# EAGLE design sepic (EAGLE 7.2.0)
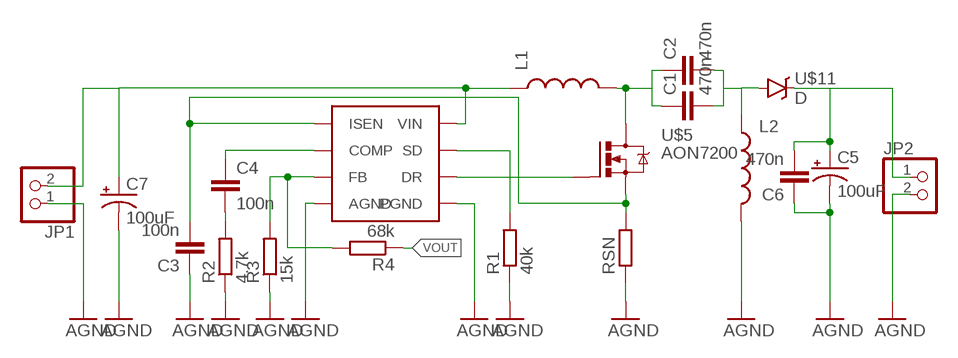
[diagram p0: schematic, sheet 1]

## Parts
C1  470n  CC0805  [C0805]
C2  470n  CC0805  [C0805]
C3  100n  CC0805  [C0805]
C4  100n  CC0805  [C0805]
C5  100uF  100UF-63V-20%(ELECT)  [NIC_10X10.5_CAP]
C6  470n  CC0805  [C0805]
C7  100uF  100UF-63V-20%(ELECT)  [NIC_10X10.5_CAP]
JP1  PINHD-1X02_2.54  [1X02]
JP2  PINHD-1X02_2.54  [1X02]
L1  INDUCTORSRU1038  [SRU1038]
L2  INDUCTORSRU1038  [SRU1038]
R1  40k  R0603  [0603]
R2  4.7k  R0805  [R0805]
R3  15k  R0805  [R0805]
R4  68k  R0805  [R0805]
RSN  R2512  [R2512]
U$1  LM3488  [S-PDSO-G8]
U$5  AON7200  [DFN3X3]
U$11  D  SS14  [SMA-DIODE]

## Nets
AGND: C3.1 C5.- C6.1 C7.- JP1.1 JP2.2 L2.2 R1.1 R2.1 R3.1 RSN.P$1 U$1.4(AGND) U$1.5(PGND)
N$1: C3.2 RSN.P$2 U$1.1(ISEN) U$5.S:1(S) U$5.S:2(S) U$5.S:3(S)
N$2: U$1.6(DR) U$5.G
N$3: R1.2 U$1.7(SD)
N$4: C1.1 C2.1 L1.2 U$5.D U$5.D:1(D) U$5.D:2(D) U$5.D:3(D) U$5.D:4(D) U$5.D:5(D) U$5.D:6(D)
N$5: C1.2 C2.2 L2.1 U$11.A
N$8: C4.1 U$1.2(COMP)
N$9: C4.2 R2.2
N$11: R3.2 R4.2 U$1.3(FB)
VIN: C7.+ JP1.2 L1.1 U$1.8(VIN)
VOUT: C5.+ C6.2 JP2.1 R4.1 U$11.C

## Library data of the parts
C1-C4 C6 = CasaLibrary:C: Capacitor
C5 C7 = SparkFun-Capacitors:100UF-63V-20%(ELECT): CAP-08362 100uF electrolytic SMT 63V 20%; PROD_ID: CAP-08362
JP1 JP2 = pinhead-2:PINHD-1X02: PIN HEADER
L1 L2 = SparkFun-Passives:INDUCTOR: Inductors Basic Inductor/Choke - 0603 and 1206. Footprints are not proven and vary greatly between part numbers. INDUCTOR POWER 3.3UH 4.0A SMD 0.197" L x 0.197" W x 0.177" H (5.00mm x 5.00mm x 4.50mm)
R1-R4 RSN = CasaLibrary:R
U$1 = CasaLibrary:LM3488
U$5 = CasaLibrary:AON7200
U$11 = CasaLibrary:SS14

## Board
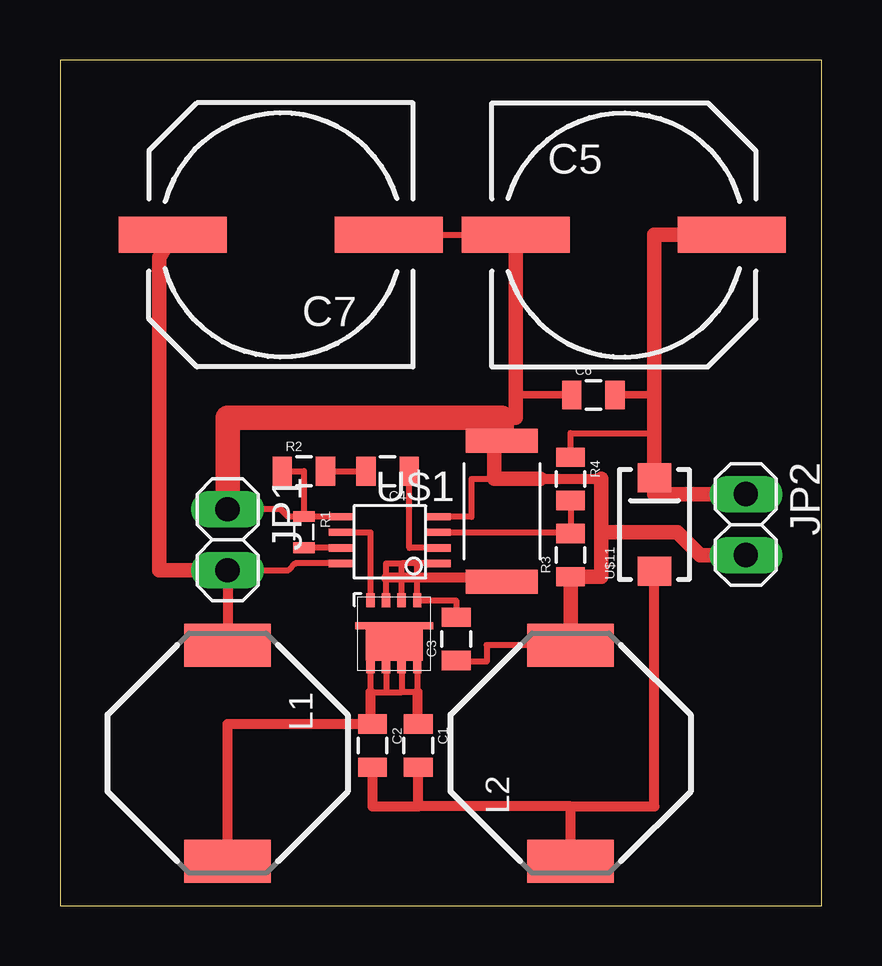
[diagram p1: board, top side]

Size 31.73 x 35.23 mm. Coordinates in mm from the lower left corner, seen from the top.
Outline: 0,0 31.73,0 31.73,35.23 0,35.23 0,0
Copper layers (1*16): Top 0.035mm / dielectric 1.5mm / Bottom 0.035mm
Design rules "default": minimum track width 0.2mm, minimum drill 0.2mm, track to track 0.2mm, track to pad 0.2mm, pad to pad 0.2mm, via to via 0.2mm, smd to smd 0.2mm, copper to edge 0.2mm, drill to drill 0.2mm, minimum pad ring 10mil, minimum via ring 8mil, stop-mask expansion 4mil, vias tented up to drill 0mil, thermal gap 10mil

### Footprints (pad centres in the part's own frame; a part is rotated, then mirrored left to right if it is on the bottom)
C0805 = smd 0.8 x 1.2: 1 -0.9,0; 2 0.9,0
NIC_10X10.5_CAP = smd 4.5 x 1.5: + 4.5,0; - -4.5,0
1X02 = drill 1.016 long: 1 -1.27,0; 2 1.27,0
SRU1038 = smd 1.8 x 3.6: 1 -4.5,0; 2 4.5,0
0603 = smd 0.45 x 0.9: 1 -0.65,0; 2 0.65,0
R0805 = smd 0.8 x 1.2: 1 -0.9,0; 2 0.9,0
R2512 = smd 1 x 3: P$1 0.318,-1.587; P$2 6.191,-1.587
S-PDSO-G8 = smd 1 x 0.305: 1 -0.55,-0.6; 2 -0.55,-1.25; 3 -0.55,-1.9; 4 -0.55,-2.55; 5 3.55,-2.55; 6 3.55,-1.9; 7 3.55,-1.25; 8 3.55,-0.6
DFN3X3 = smd 1.6 x 2.375: D -0.425,0.05 | smd 0.3 x 0.8: D:1 0.225,1.275; D:2 0.225,-1.175 | smd 0.6 x 0.35: D:3 -1.461,-0.916; D:4 -1.461,-0.266; D:5 -1.461,0.384; D:6 -1.461,1.034; G 1.289,1.034; S:1 1.289,0.384; S:2 1.289,-0.266; S:3 1.289,-0.916
SMA-DIODE = smd 1.2 x 1.4: A -1.95,0; C 1.95,0

### Placement (x,y rotation side)
C1  14.92,6.67 270 top
C2  13.02,6.67 270 top
C3  16.51,11.11 90 top
C4  13.65,18.1 180 top
C5  23.5,27.94 0 top
C6  22.22,21.27 0 top
C7  9.21,27.94 180 top
JP1  6.98,15.24 270 top
JP2  28.57,15.88 270 top
L1  6.98,6.35 270 top
L2  21.27,6.35 90 top
R1  10.16,15.56 270 top
R2  10.16,18.1 0 top
R3  21.27,14.61 90 top
R4  21.27,17.78 270 top
RSN  20,19.69 270 top
U$1  15.24,13.65 180 top
U$5  13.97,11.43 90 top
U$11  24.77,15.88 90 top

### Tracks (layer width: path | path; a pad name or v marks a point on that pad's centre or on a via)
AGND
  Top 0.254: U$1.5 R1.1 | R1.1 9.51,16.21 9.21,16.51 JP1.1 | U$1.4 15.79,16.19 17.14,16.19 17.14,17.78 18.1,17.78 | R2.1 10.16,18.1 R1.1 | C7.- C5.- | L2.2 17.78,10.85 17.78,10.16 16.51,10.16 C3.1
  Top 0.305: C6.1 19,21.27
  Top 0.406: 20,17.78 22.54,17.78
  Top 0.61: C5.- 19,21.27 19,20.32 18.41,20.32 | JP2.2 26.67,14.61 25.72,15.56 22.54,15.56 | 18.1,20.32 18.1,17.78 20,17.78 | 22.54,15.56 22.54,17.78 | 21.27,10.79 L2.2 R3.1 22.54,13.71 22.54,15.56
  Top 1.016: JP1.1 6.98,20.32 18.1,20.32 18.41,20.32 RSN.P$1
N$1
  Top 0.254: U$1.1 14.89,14.25 | 14.89,14.25 14.24,14.25 | U$5.S:2 14.24,14.25 | U$5.S:1 13.59,13.65 13.59,14.25 14.24,14.25 | 14.89,14.25 U$5.S:3 16.51,12.72 C3.2
  Top 0.406: RSN.P$2 18.41,13.65 13.59,13.65
N$2
  Top 0.254: U$1.6 12.94,15.55 U$5.G
N$3
  Top 0.254: U$1.7 R1.2
N$4
  Top 0.254: U$5.D:1 13.27,11.65 arc-90 U$5.D | U$5.D:2 14.57,11.65 arc90 U$5.D | U$5.D arc90 13.59,10.67 U$5.D:5 13.59,8.89 | U$5.D:6 12.94,8.89 13.59,8.89 | 13.59,8.89 14.24,8.89 | U$5.D:3 14.89,8.89 14.24,8.89 | U$5.D:4 14.24,8.89
  Top 0.406: 12.94,8.89 12.94,7.57 C2.1 6.98,7.57 L1.2 | 14.89,8.89 14.89,7.57 C1.1
N$5
  Top 0.406: C2.2 13.02,4.13 14.92,4.13 | 14.92,4.13 C1.2 | L2.1 21.27,4.13 | 21.27,4.13 14.92,4.13 | 21.27,4.13 24.77,4.13 U$11.A
N$8
  Top 0.254: U$1.2 14.55,14.9 C4.1
N$9
  Top 0.254: R2.2 C4.2
N$11
  Top 0.254: U$1.3 21.22,15.55 arc-90 R3.2 R4.2
VIN
  Top 0.254: JP1.2 9.53,13.97 9.81,14.25 U$1.8
  Top 0.406: JP1.2 L1.1
  Top 0.61: JP1.2 4.13,13.97 4.13,26.99 C7.+
VOUT
  Top 0.254: R4.1 21.27,19.69 24.77,19.69 U$11.C
  Top 0.305: C6.2 24.77,21.27
  Top 0.61: C5.+ 24.77,27.94 24.77,21.27 U$11.C 24.77,17.15 JP2.1